# Altium schematic sheet VCCINT Step-Down.SchDoc
size A4; SheetNumber: 3; SheetTotal: 3
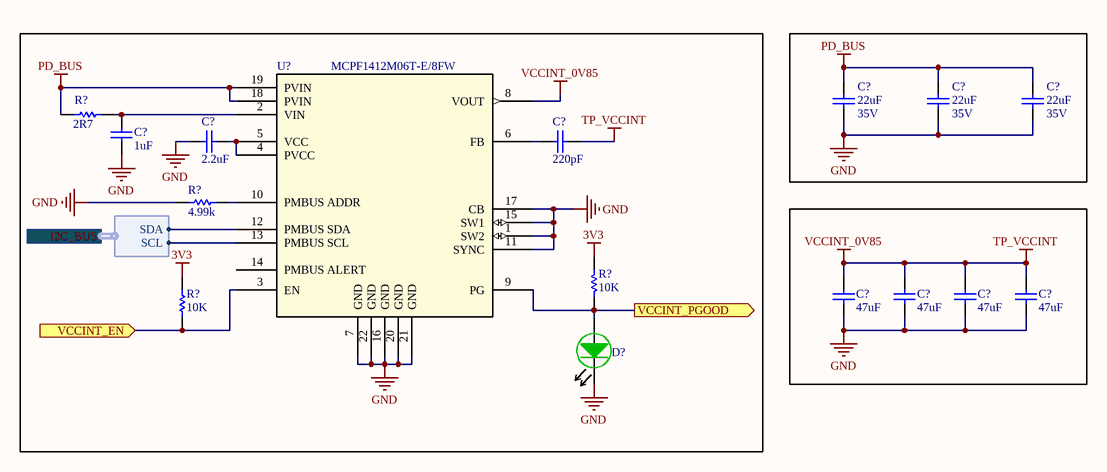
[diagram p0: VCCINT Step-Down.SchDoc]

## Parts
(Parts that share a designator on the sheet are numbered #1, #2 ... from top to bottom, then left to right.)
C?#1  value 22uF  VOLTAGE: 35V  [0805-C-R]  (hidden comment: C2012X5R1V226M125AC)
C?#2  value 22uF  VOLTAGE: 35V  [0805-C-R]  (hidden comment: C2012X5R1V226M125AC)
C?#3  value 22uF  VOLTAGE: 35V  [0805-C-R]  (hidden comment: C2012X5R1V226M125AC)
C?#4  value 2.2uF  [0402-C-R]  (hidden comment: 885012105013)
C?#5  value 220pF  [0402-C-R]  (hidden comment: GRM1555C1H221JA01D)
C?#6  value 1uF  [0402-C-R]  (hidden comment: JMK105BJ105KV-F)
C?#7  value 47uF  [0603-C-R]  (hidden comment: ZRB18AR60J476ME01L)
C?#8  value 47uF  [0603-C-R]  (hidden comment: ZRB18AR60J476ME01L)
C?#9  value 47uF  [0603-C-R]  (hidden comment: ZRB18AR60J476ME01L)
C?#10  value 47uF  [0603-C-R]  (hidden comment: ZRB18AR60J476ME01L)
D?  LNJ347W83RA  [LED_0402]  (value not drawn)
R?#1  value 2R7  [0402-R-R]  (hidden comment: ERJ-2GEJ2R7X)
R?#2  Resistence: 4.99k  [0402-R-R]  (hidden comment: RMCF0402FT4K99)
R?#3  value 10K  [0402-R-R]  (hidden comment: RC0402FR-0710KL)
R?#4  value 10K  [0402-R-R]  (hidden comment: RC0402FR-0710KL)
U?  MCPF1412M06T-E/8FW  [LGA_MCPF1412M06T-E8FW_MCH]

## Ports
I2C_BUS (harness I2C), VCCINT_EN (in), VCCINT_PGOOD (out)

## Harnesses
I2C: SDA, SCL

## Nets
3V3: R?#3.2 R?#4.2
GND: C?#1.1 C?#2.1 C?#3.1 C?#4.1 C?#6.1 C?#7.1 C?#8.1 C?#9.1 C?#10.1 D?.1(K) R?#2.1 U?.1(SW2) U?.7(GND) U?.11(SYNC) U?.15(SW1) U?.16(GND) U?.17(CB) U?.20(GND) U?.21(GND) U?.22(GND)
PD_BUS: C?#1.2 C?#2.2 C?#3.2 R?#1.1 U?.18(PVIN) U?.19(PVIN)
TP_VCCINT: C?#5.2 C?#7.2 C?#8.2 C?#9.2 C?#10.2 U?.8(VOUT)  [also labelled VCCINT_0V85]
VCCINT_EN: R?#4.1 U?.3(EN) ; port VCCINT_EN
VCCINT_PGOOD: D?.2(A) R?#3.1 U?.9(PG) ; port VCCINT_PGOOD
NetC?#4_2: C?#4.2 U?.4(PVCC) U?.5(VCC)
NetC?#5_1: C?#5.1 U?.6(FB)
NetC?#6_2: C?#6.2 R?#1.2 U?.2(VIN)
NetR?#2_2: R?#2.2 U?.10(PMBUS_ADDR)
NetU?_12: U?.12(PMBUS_SDA) ; port I2C_BUS.SDA
NetU?_13: U?.13(PMBUS_SCL) ; port I2C_BUS.SCL

Not connected (* = marked no-connect by the designer): U? 14(PMBUS_ALERT)

## Library data of the parts
C?#1-C?#3 = CAP CER 22UF 35V X5R 0805: 22 µF ±20% 35V Ceramic Capacitor X5R 0805 (2012 Metric); SIZE: 0603; PN: C2012X5R1V226M125AC; TOLERANCE: 20%
C?#4 = CAP CER 2.2UF 10V X5R 0402: 2.2 µF ±20% 10V Ceramic Capacitor X5R 0402 (1005 Metric); SIZE: 0402; VOLTAGE: 10V; TOLERANCE: 20%; PN: 885012105013
C?#5 = CAP CER 220PF 50V C0G/NP0 0402: 220 pF ±5% 50V Ceramic Capacitor C0G, NP0 0402 (1005 Metric); SIZE: 0402; VOLTAGE: 50V; TOLERANCE: 5%; PN: GRM1555C1H221JA01D
C?#6 = CAP CER 1UF 6.3V X5R 0402: 1 µF ±10% 6.3V Ceramic Capacitor X5R 0402 (1005 Metric); SIZE: 0402; VOLTAGE: 6.3V; TOLERANCE: 10%; PN: JMK105BJ105KV-F
C?#7-C?#10 = CAP CER 47UF 6.3V X5R 0603: 22 µF ±20% 10V Ceramic Capacitor X5R 0603 (1608 Metric); VOLTAGE: 6.3V; SIZE: 0603; PN: ZRB18AR60J476ME01L; TOLERANCE: 20%
D? = LED GREEN 0402 SMD: Green 572nm LED Indication - Discrete 1.95V 0402 (1005 Metric); ID: ?; PN: LNJ347W83RA
R?#1 = RES SMD 2.7 OHM 5% 1/10W 0402: 2.7 Ohms ±5% 0.1W, 1/10W Chip Resistor 0402 (1005 Metric) Automotive AEC-Q200 Thick Film; PACK: 0402; TOLERANCE: 5%; POWER: 0.1W; PN: ERJ-2GEJ2R7X
R?#2 = RES SMD 4K99 OHM 1% 1/16W 0402: 4.99 kOhms ±0.1% 0.063W, 1/16W Chip Resistor 0402 (1005 Metric) Automotive AEC-Q200 Thin Film; Mfr_Name: Yageo; Tolerance: 1%; PN: RMCF0402FT4K99
R?#3 R?#4 = RES 10K OHM 1% 1/16W 0402: 10 kOhms ±1% 0,063W, 1/16W Resistor de chip 0402 (métrico 1005) Resistente à umidade Filme grosso; PACK: 0402; POWER: 0.063W; TOLERANCE: 1%; PN: RC0402FR-0710KL
U? = IC POWER MODULE 12A, 16V: Non-Isolated PoL Module DC DC Converter 1 Output 0.6 ~ 1.8V 12A 4.5V - 16V Input; Manufacturer_Name: Microchip; Copyright: Copyright (C) 2025 Ultra Librarian. All rights reserved.; Manufacturer_Part_Number: MCPF1412M06T-E/8FW; RefDes: RefDes; Type: Type; PN: MCPF1412M06T-E/8FW